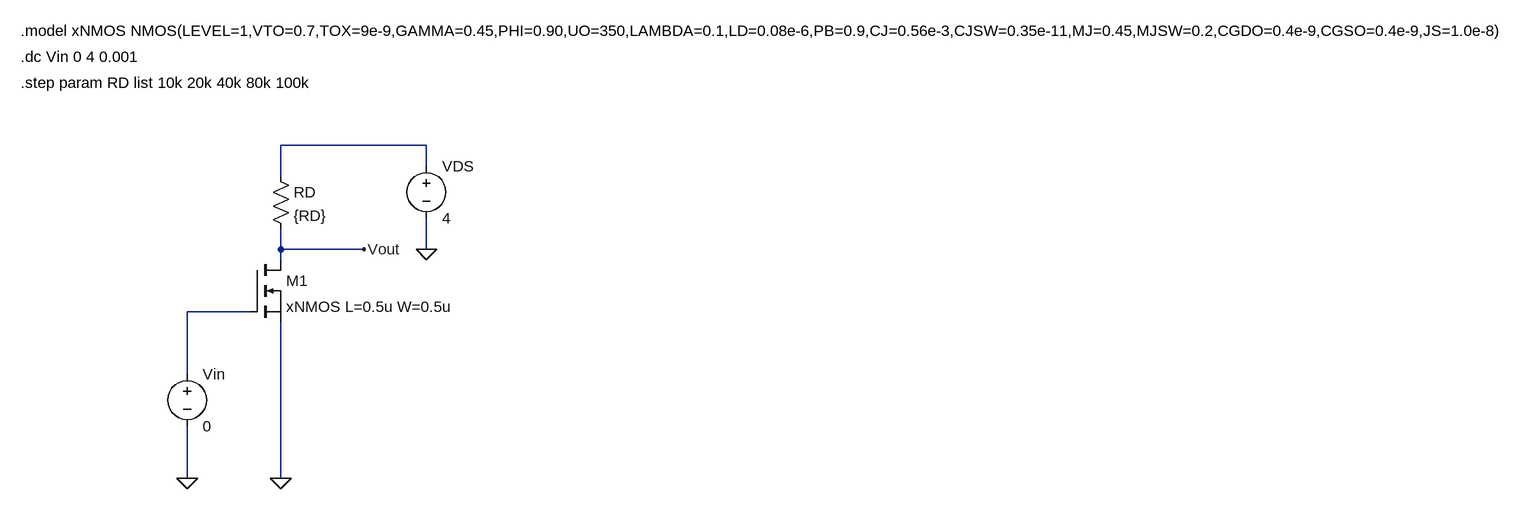
[diagram p0: schematic Chapter03_SPICE01.asc]
Chapter03_SPICE01.asc, the LTspice schematic file:
Version 4
SHEET 1 2480 888
WIRE 672 336 448 336
WIRE 672 368 672 336
WIRE 448 384 448 336
WIRE 448 496 448 464
WIRE 576 496 448 496
WIRE 672 496 672 448
WIRE 448 512 448 496
WIRE 400 592 304 592
WIRE 304 688 304 592
WIRE 304 848 304 768
WIRE 448 848 448 608
FLAG 448 848 0
FLAG 304 848 0
FLAG 672 496 0
FLAG 576 496 Vout
SYMBOL nmos 400 512 R0
SYMATTR InstName M1
SYMATTR Value xNMOS L=0.5u W=0.5u
SYMBOL voltage 304 672 R0
WINDOW 123 0 0 Left 0
WINDOW 39 0 0 Left 0
SYMATTR InstName Vin
SYMATTR Value 0
SYMBOL voltage 672 352 R0
WINDOW 123 0 0 Left 0
WINDOW 39 0 0 Left 0
SYMATTR InstName VDS
SYMATTR Value 4
SYMBOL res 432 368 R0
SYMATTR InstName RD
SYMATTR Value {RD}
TEXT 48 160 Left 2 !.model xNMOS NMOS(LEVEL=1,VTO=0.7,TOX=9e-9,GAMMA=0.45,PHI=0.90,UO=350,LAMBDA=0.1,LD=0.08e-6,PB=0.9,CJ=0.56e-3,CJSW=0.35e-11,MJ=0.45,MJSW=0.2,CGDO=0.4e-9,CGSO=0.4e-9,JS=1.0e-8)
TEXT 48 200 Left 2 !.dc Vin 0 4 0.001
TEXT 48 240 Left 2 !.step param RD list 10k 20k 40k 80k 100k

The netlist it stands for:
* Chapter03_SPICE01.asc
M1 Vout N002 0 0 xNMOS L=0.5u W=0.5u
Vin N002 0 0
VDS N001 0 4
RD N001 Vout {RD}
.model NMOS NMOS
.model PMOS PMOS
.lib standard.mos
.model xNMOS NMOS(LEVEL=1,VTO=0.7,TOX=9e-9,GAMMA=0.45,PHI=0.90,UO=350,LAMBDA=0.1,LD=0.08e-6,PB=0.9,CJ=0.56e-3,CJSW=0.35e-11,MJ=0.45,MJSW=0.2,CGDO=0.4e-9,CGSO=0.4e-9,JS=1.0e-8)
.dc Vin 0 4 0.001
.step param RD list 10k 20k 40k 80k 100k
.backanno
.end